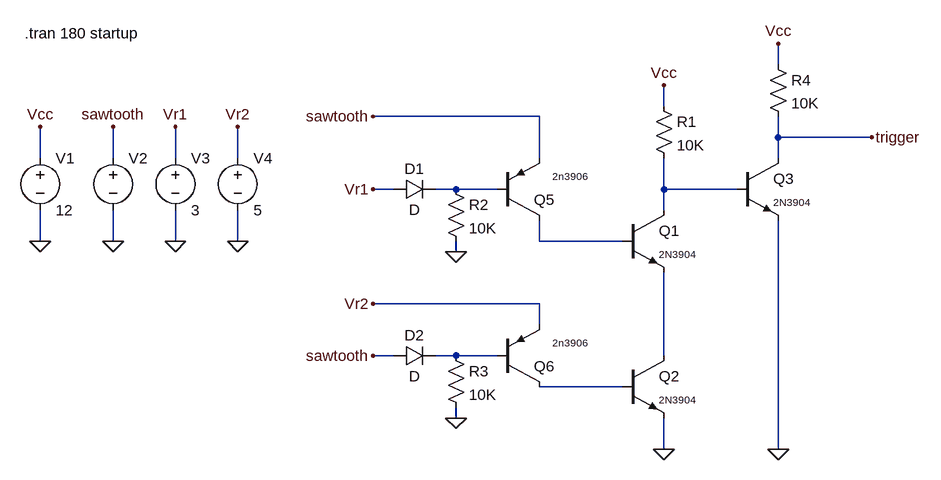
[diagram p0: schematic window-comparator.asc]
window-comparator.asc, the LTspice schematic file:
Version 4
SHEET 1 1076 980
WIRE -1344 48 -1344 16
WIRE -1520 112 -1520 80
WIRE -1712 128 -1968 128
WIRE -1344 160 -1344 128
WIRE -1200 160 -1344 160
WIRE -2480 192 -2480 144
WIRE -2368 192 -2368 144
WIRE -2272 192 -2272 144
WIRE -2176 192 -2176 144
WIRE -1712 192 -1712 128
WIRE -1344 192 -1344 160
WIRE -1936 240 -1968 240
WIRE -1840 240 -1872 240
WIRE -1776 240 -1840 240
WIRE -1520 240 -1520 192
WIRE -1408 240 -1520 240
WIRE -1520 272 -1520 240
WIRE -2480 320 -2480 272
WIRE -2368 320 -2368 272
WIRE -2272 320 -2272 272
WIRE -2176 320 -2176 272
WIRE -1712 320 -1712 288
WIRE -1584 320 -1712 320
WIRE -1840 336 -1840 320
WIRE -1712 416 -1968 416
WIRE -1712 448 -1712 416
WIRE -1936 496 -1968 496
WIRE -1840 496 -1872 496
WIRE -1776 496 -1840 496
WIRE -1520 496 -1520 368
WIRE -1584 544 -1712 544
WIRE -1840 592 -1840 576
WIRE -1520 640 -1520 592
WIRE -1344 640 -1344 288
FLAG -2480 320 0
FLAG -2480 144 Vcc
FLAG -2368 320 0
FLAG -2368 144 sawtooth
FLAG -2272 320 0
FLAG -2272 144 Vr1
FLAG -2176 320 0
FLAG -2176 144 Vr2
FLAG -1968 128 sawtooth
FLAG -1968 240 Vr1
FLAG -1520 80 Vcc
FLAG -1520 640 0
FLAG -1840 336 0
FLAG -1840 592 0
FLAG -1968 416 Vr2
FLAG -1968 496 sawtooth
FLAG -1200 160 trigger
FLAG -1344 16 Vcc
FLAG -1344 640 0
SYMBOL voltage -2480 176 R0
WINDOW 123 0 0 Left 0
WINDOW 39 0 0 Left 0
SYMATTR InstName V1
SYMATTR Value 12
SYMBOL voltage -2368 176 R0
WINDOW 123 0 0 Left 0
WINDOW 39 0 0 Left 0
WINDOW 3 24 96 Invisible 2
SYMATTR Value PULSE(0 7.4 0 60s 0 0 60s)
SYMATTR InstName V2
SYMBOL voltage -2272 176 R0
WINDOW 123 0 0 Left 0
WINDOW 39 0 0 Left 0
SYMATTR InstName V3
SYMATTR Value 3
SYMBOL voltage -2176 176 R0
WINDOW 123 0 0 Left 0
WINDOW 39 0 0 Left 0
SYMATTR InstName V4
SYMATTR Value 5
SYMBOL pnp -1776 288 M180
WINDOW 3 84 68 Left 1
SYMATTR Value 2n3906
SYMATTR InstName Q5
SYMBOL pnp -1776 544 M180
WINDOW 3 84 68 Left 1
SYMATTR Value 2n3906
SYMATTR InstName Q6
SYMBOL npn -1584 272 R0
WINDOW 3 56 68 Left 1
SYMATTR Value 2N3904
SYMATTR InstName Q1
SYMBOL res -1536 96 R0
SYMATTR InstName R1
SYMATTR Value 10K
SYMBOL diode -1936 256 R270
WINDOW 0 32 32 VTop 2
WINDOW 3 0 32 VBottom 2
SYMATTR InstName D1
SYMBOL diode -1936 512 R270
WINDOW 0 32 32 VTop 2
WINDOW 3 0 32 VBottom 2
SYMATTR InstName D2
SYMBOL res -1856 224 R0
SYMATTR InstName R2
SYMATTR Value 10K
SYMBOL res -1856 480 R0
SYMATTR InstName R3
SYMATTR Value 10K
SYMBOL npn -1584 496 R0
WINDOW 3 56 68 Left 1
SYMATTR Value 2N3904
SYMATTR InstName Q2
SYMBOL npn -1408 192 R0
WINDOW 3 56 68 Left 1
SYMATTR Value 2N3904
SYMATTR InstName Q3
SYMBOL res -1360 32 R0
SYMATTR InstName R4
SYMATTR Value 10K
TEXT -2504 0 Left 2 !.tran 180 startup

The netlist it stands for:
* window-comparator.asc
V1 Vcc 0 12
V2 sawtooth 0 PULSE(0 7.4 0 60s 0 0 60s)
V3 Vr1 0 3
V4 Vr2 0 5
Q5 N003 N001 sawtooth 0 2n3906
Q6 N006 N004 Vr2 0 2n3906
Q1 N002 N003 N005 0 2N3904
R1 Vcc N002 10K
D1 Vr1 N001 D
D2 sawtooth N004 D
R2 N001 0 10K
R3 N004 0 10K
Q2 N005 N006 0 0 2N3904
Q3 trigger N002 0 0 2N3904
R4 Vcc trigger 10K
.model D D
.lib standard.dio
.model NPN NPN
.model PNP PNP
.lib standard.bjt
.tran 180 startup
.backanno
.end